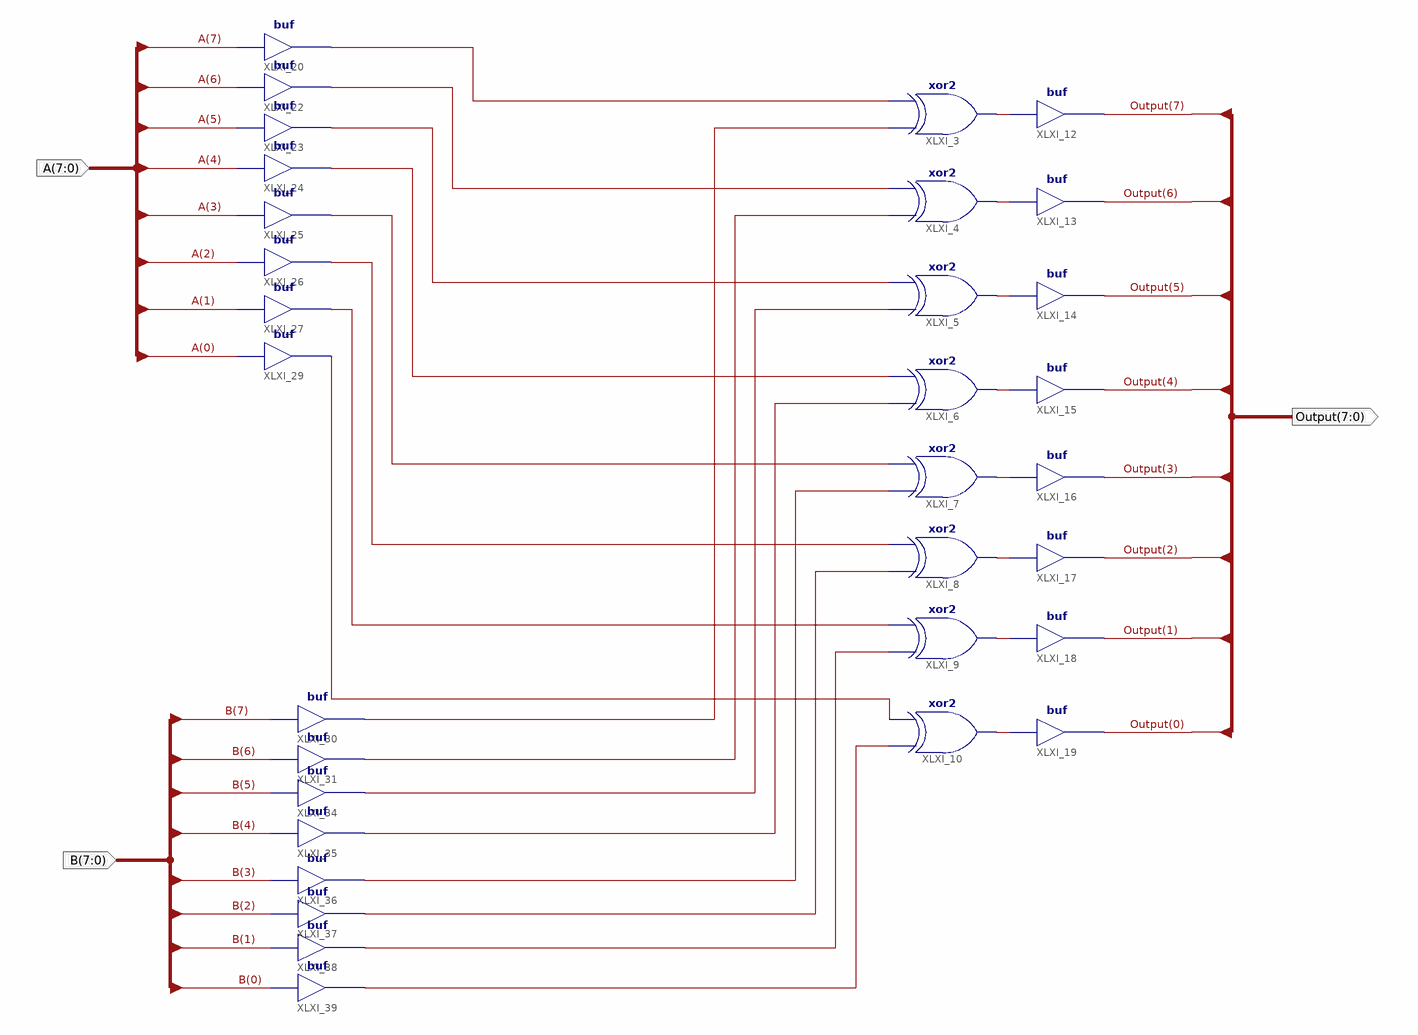
[diagram p0: schematic sheet 1]
// Xilinx ISE schematic XOR_8.sch (spartan6) as structural Verilog: 32 symbols, 3 ports
module XOR_8 (
  input  [7:0] A,
  input  [7:0] B,
  output [7:0] Output
);

  wire XLXN_1, XLXN_2, XLXN_3, XLXN_4, XLXN_5, XLXN_6, XLXN_7, XLXN_8, XLXN_18, XLXN_40, XLXN_41, XLXN_42,
       XLXN_43, XLXN_44, XLXN_45, XLXN_46, XLXN_55, XLXN_93, XLXN_94, XLXN_95, XLXN_96, XLXN_97, XLXN_98,
       XLXN_99;

  buf XLXI_20 (XLXN_18, A[7]);
  buf XLXI_22 (XLXN_40, A[6]);
  buf XLXI_23 (XLXN_41, A[5]);
  buf XLXI_24 (XLXN_42, A[4]);
  buf XLXI_25 (XLXN_43, A[3]);
  buf XLXI_26 (XLXN_44, A[2]);
  buf XLXI_27 (XLXN_45, A[1]);
  buf XLXI_29 (XLXN_46, A[0]);
  buf XLXI_19 (Output[0], XLXN_8);
  buf XLXI_18 (Output[1], XLXN_7);
  buf XLXI_17 (Output[2], XLXN_6);
  buf XLXI_16 (Output[3], XLXN_5);
  buf XLXI_15 (Output[4], XLXN_4);
  buf XLXI_14 (Output[5], XLXN_3);
  buf XLXI_13 (Output[6], XLXN_2);
  buf XLXI_12 (Output[7], XLXN_1);
  xor XLXI_10 (XLXN_8, XLXN_98, XLXN_46);
  xor XLXI_9 (XLXN_7, XLXN_99, XLXN_45);
  xor XLXI_8 (XLXN_6, XLXN_97, XLXN_44);
  xor XLXI_7 (XLXN_5, XLXN_96, XLXN_43);
  xor XLXI_6 (XLXN_4, XLXN_95, XLXN_42);
  xor XLXI_5 (XLXN_3, XLXN_94, XLXN_41);
  xor XLXI_4 (XLXN_2, XLXN_93, XLXN_40);
  xor XLXI_3 (XLXN_1, XLXN_55, XLXN_18);
  buf XLXI_39 (XLXN_98, B[0]);
  buf XLXI_38 (XLXN_99, B[1]);
  buf XLXI_37 (XLXN_97, B[2]);
  buf XLXI_36 (XLXN_96, B[3]);
  buf XLXI_35 (XLXN_95, B[4]);
  buf XLXI_34 (XLXN_94, B[5]);
  buf XLXI_31 (XLXN_93, B[6]);
  buf XLXI_30 (XLXN_55, B[7]);
endmodule
